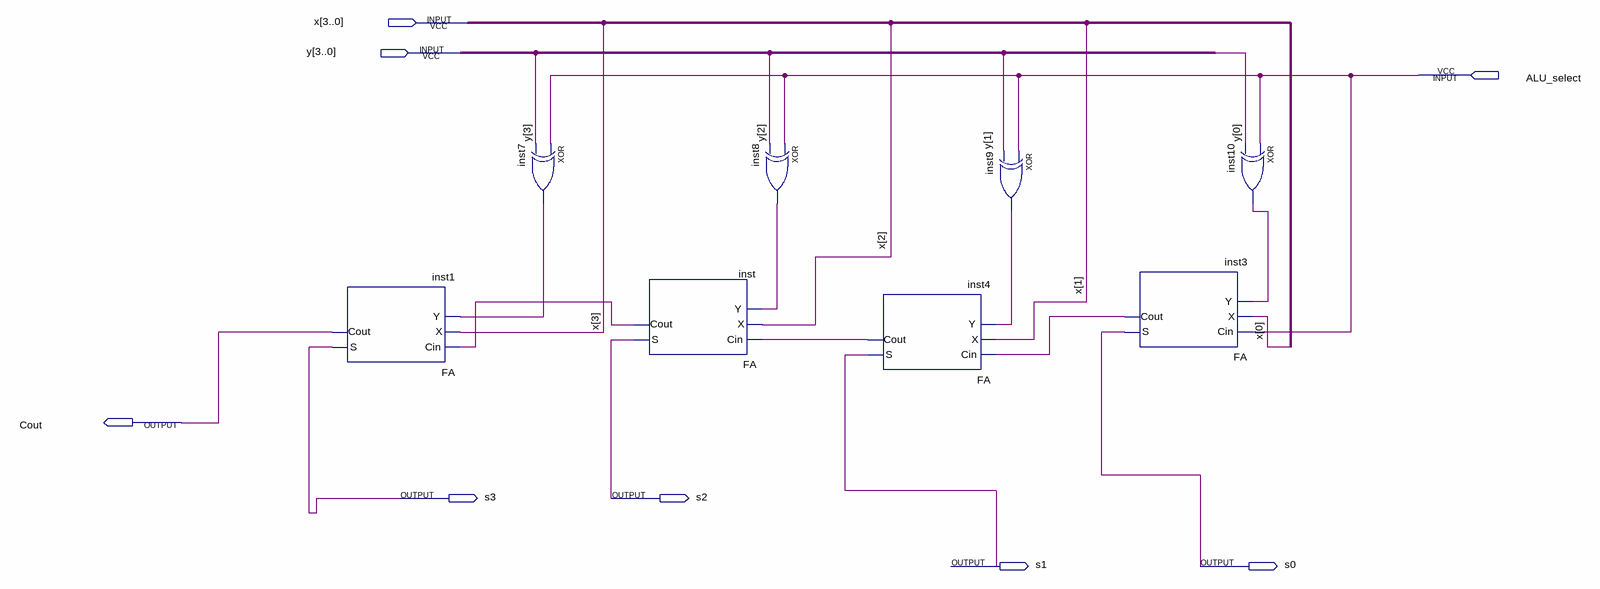
[diagram p0: schematic sheet]
// Quartus schematic adder_subtractor.bdf as structural Verilog: 8 symbols, 8 pins
module adder_subtractor (
  input  [3:0] x,
  input  [3:0] y,
  input  ALU_select,
  output Cout,
  output s3,
  output s2,
  output s1,
  output s0
);

  wire inst3_cout, inst4_cout, inst7_out, inst8_out, inst9_out, inst10_out, inst_cout;

  FA inst1 (.Cin(inst_cout), .X(x[3]), .Y(inst7_out), .S(s3), .Cout(Cout));
  xor inst7 (inst7_out, ALU_select, y[3]);
  FA inst (.Cin(inst4_cout), .X(x[2]), .Y(inst8_out), .S(s2), .Cout(inst_cout));
  xor inst8 (inst8_out, ALU_select, y[2]);
  FA inst4 (.Cin(inst3_cout), .X(x[1]), .Y(inst9_out), .S(s1), .Cout(inst4_cout));
  xor inst9 (inst9_out, ALU_select, y[1]);
  FA inst3 (.Cin(ALU_select), .X(x[0]), .Y(inst10_out), .S(s0), .Cout(inst3_cout));
  xor inst10 (inst10_out, ALU_select, y[0]);
endmodule
